# Altium schematic sheet Block_Diagramme.SchDoc
size A4; SheetNumber: 1; SheetTotal: 5
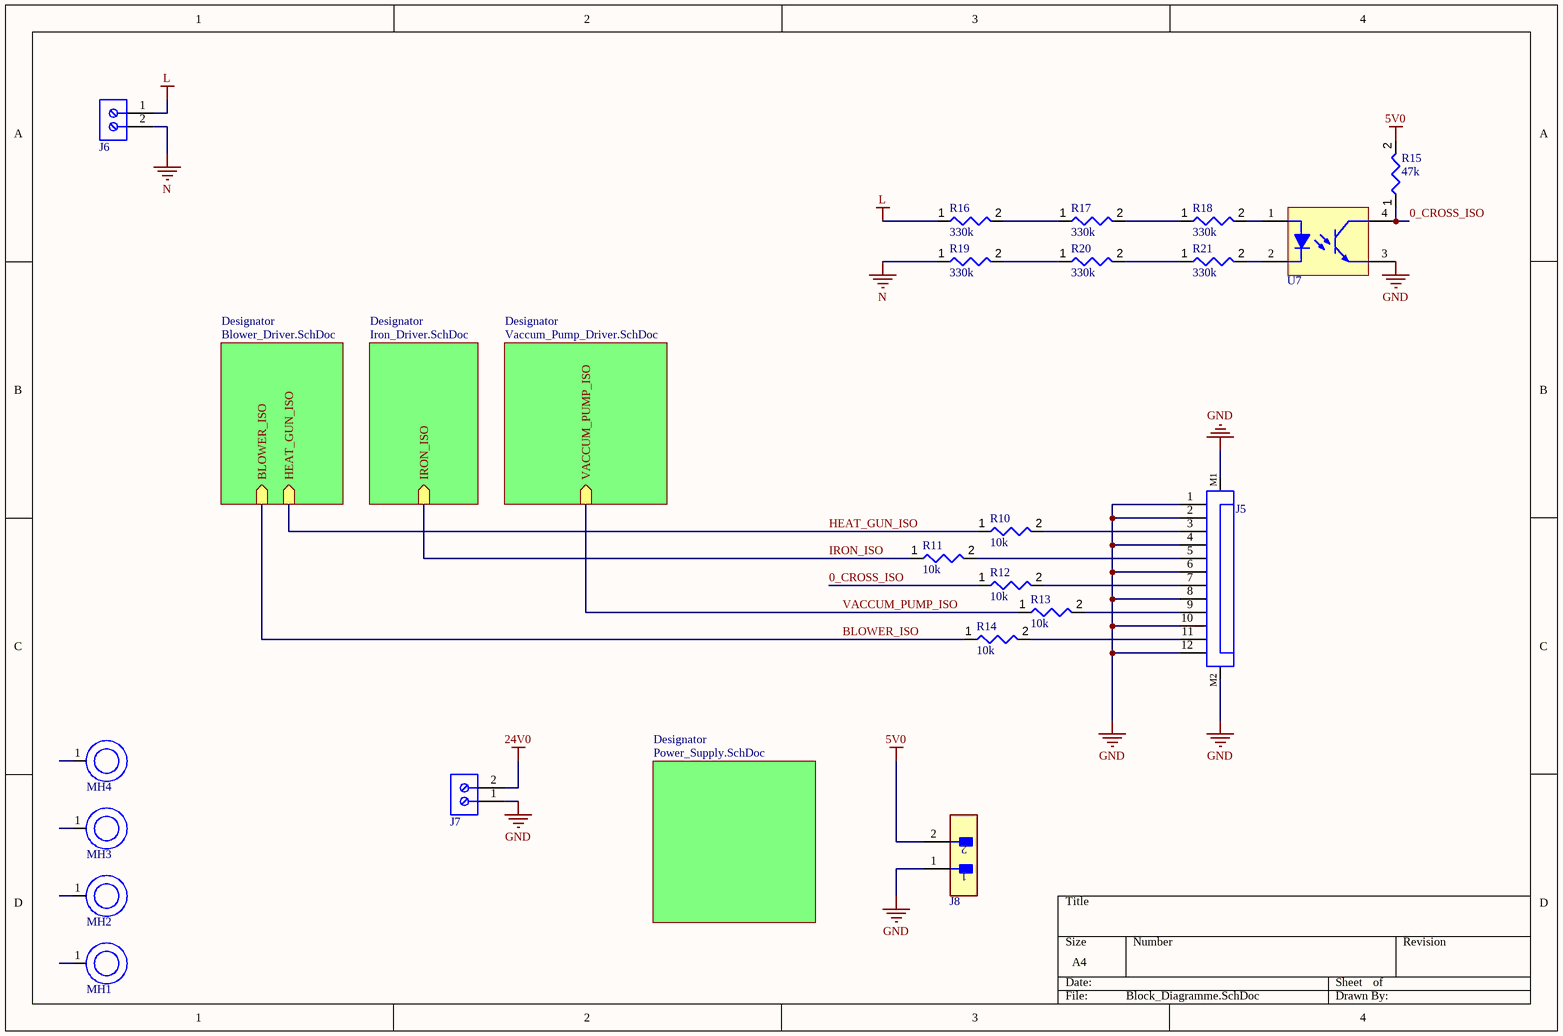
[diagram p0: Block_Diagramme.SchDoc]

## Parts
J5  687112183622  [687112183622]  (value not drawn)
J6  691137710002  [691137710002]  (value not drawn)
J7  691137710002  [691137710002]  (value not drawn)
J8  B2B-XH-A(LF)(SN)  [FP-B2B-XH-A_LF_SN-MFG]  (value not drawn)
MH1  3mm_Mounting_Hole  [Single_3mm_Mounting_Hole]  (value not drawn)
MH2  3mm_Mounting_Hole  [Single_3mm_Mounting_Hole]  (value not drawn)
MH3  3mm_Mounting_Hole  [Single_3mm_Mounting_Hole]  (value not drawn)
MH4  3mm_Mounting_Hole  [Single_3mm_Mounting_Hole]  (value not drawn)
R10  value 10k  [Generic_0603_RES]  (hidden comment: RES-TK_SMD-0603_VIS-CRCW_K_10K_1/10W_1%)
R11  value 10k  [Generic_0603_RES]  (hidden comment: RES-TK_SMD-0603_VIS-CRCW_K_10K_1/10W_1%)
R12  value 10k  [Generic_0603_RES]  (hidden comment: RES-TK_SMD-0603_VIS-CRCW_K_10K_1/10W_1%)
R13  value 10k  [Generic_0603_RES]  (hidden comment: RES-TK_SMD-0603_VIS-CRCW_K_10K_1/10W_1%)
R14  value 10k  [Generic_0603_RES]  (hidden comment: RES-TK_SMD-0603_VIS-CRCW_K_10K_1/10W_1%)
R15  value 47k  [Generic_0603_RES]  (hidden comment: RES-TK_SMD-0603_VIS-CRCW_K_47K_1/10W_1%)
R16  value 330k  [Generic_1206_RES]  (hidden comment: RES-TK_SMD-1206_VIS-CRCW_K_330K_1/4W_1%)
R17  value 330k  [Generic_1206_RES]  (hidden comment: RES-TK_SMD-1206_VIS-CRCW_K_330K_1/4W_1%)
R18  value 330k  [Generic_1206_RES]  (hidden comment: RES-TK_SMD-1206_VIS-CRCW_K_330K_1/4W_1%)
R19  value 330k  [Generic_1206_RES]  (hidden comment: RES-TK_SMD-1206_VIS-CRCW_K_330K_1/4W_1%)
R20  value 330k  [Generic_1206_RES]  (hidden comment: RES-TK_SMD-1206_VIS-CRCW_K_330K_1/4W_1%)
R21  value 330k  [Generic_1206_RES]  (hidden comment: RES-TK_SMD-1206_VIS-CRCW_K_330K_1/4W_1%)
U7  H11A817ASD  [FAIR-H11A817ASD-4_V]  (value not drawn)

## Sub-sheets
Designator = Blower_Driver.SchDoc: BLOWER_ISO (in), HEAT_GUN_ISO (in)
Designator = Iron_Driver.SchDoc: IRON_ISO (in)
Designator = Vaccum_Pump_Driver.SchDoc: VACCUM_PUMP_ISO (in)
Designator = Power_Supply.SchDoc: no entries

## Nets
5V0: J8.2 R15.2
24V0: J7.2
GND: J5.1 J5.2 J5.4 J5.6 J5.8 J5.10 J5.12 J5.M1 J5.M2 J7.1 J8.1 U7.3(EMITTER)
L: J6.1 R16.1
N: J6.2 R19.1
0_CROSS_ISO: R12.1 R15.1 U7.4(COLLECTOR)
BLOWER_ISO: R14.1 ; sheet Designator/BLOWER_ISO
HEAT_GUN_ISO: R10.1 ; sheet Designator/HEAT_GUN_ISO
IRON_ISO: R11.1 ; sheet Designator/IRON_ISO
VACCUM_PUMP_ISO: R13.1 ; sheet Designator/VACCUM_PUMP_ISO
NetJ5_3: J5.3 R10.2
NetJ5_5: J5.5 R11.2
NetJ5_7: J5.7 R12.2
NetJ5_9: J5.9 R13.2
NetJ5_11: J5.11 R14.2
NetR16_2: R16.2 R17.1
NetR17_2: R17.2 R18.1
NetR18_2: R18.2 U7.1(ANODE)
NetR19_2: R19.2 R20.1
NetR20_2: R20.2 R21.1
NetR21_2: R21.2 U7.2(CATHODE)

Not connected (* = marked no-connect by the designer): MH1 1; MH2 1; MH3 1; MH4 1

## Library data of the parts
J5 = CMP-1502-01592-2: NexarPartId: 81848331; Gender: Receptacle; Contact Resistance: 30mΩ; Pitch: 500µm; Current Rating: 400mA; Insulation Resistance: 100MΩ; Operating Supply Voltage: 50V; Min Operating Temperature: -25°C; Packaging: Tape and Reel; Orientation: Horizontal; Number of Pins: 12; Length: 6.6mm; Max Operating Temperature: 85°C; Lead Pitch: 500µm; RoHS: Compliant
J6 J7 = CMP-001-0029-2: 2P Block Terminal; RoHS Compliant: Yes
J8 = CMP-001-0161-1: CONNECTOR HEADER, XH SERIES, 2 POSITION, 2.50MM, Press-Fit Solder, Detent Lock, Natural; Current Rating: 3A; Connector Type: Male Pin; Voltage Rating (AC): 250V; Wire/Cable Gauge: 22AWG; Number of Contacts: 2; Pitch: 2.5mm; Contact Resistance: 20mΩ; Insulation Resistance: 1GΩ; Fastening Type: Detent; REACH SVHC: Yes; Orientation: Straight; Depth: 5.75mm; Width: 6.35mm; Max Operating Temperature: 85°C; Mounting Technology: Through Hole; China RoHS: Compliant; Lead Pitch: 2.5mm; Contact Gender: Male; Contact Material: Copper, Tin; Terminal Pitch: 2.5mm; Termination: Solder; Max Voltage Rating (AC): 250V; Lead Free: Lead Free; Pins: 2; Color: Natural; Lifecycle Status: Production; Max Current Rating: 3A; Height: 7mm; Min Operating Temperature: -25°C; Weight: 28.349523g; Housing Color: White; Number of Rows: 1; Length: 7.4mm; Housing Material: Polyamide; Voltage Rating: 250V; Max Voltage Rating (DC): 250V; Number of Positions: 2; Contact Plating: Tin; RoHS: Compliant
MH1-MH4 = CMP-001-0046-3: 3.2mm, sPad Mounting Hole; Size: 3mm
R10-R14 = CMP-009-00246-1: Fixed Resistor, Metal Glaze/thick Film, 0.1W, 10000ohm, 75V, 1% +/-Tol, 100ppm/Cel, Surface Mount, 0603; Power: 100mW; Mounting Technology: Surface Mount; Pins: 2; Min Operating Temperature: -55°C; Tolerance: 1%; RoHS Compliant: Yes; Max Operating Temperature: 155°C; Case/Package: 0603; Voltage Rating: 75V
R15 = CMP-009-00207-2: Fixed Resistor, Metal Glaze/thick Film, 0.1W, 47000ohm, 75V, 1% +/-Tol, 100ppm/Cel, Surface Mount, 0603; Power: 100mW; Case/Package: 0603; Max Operating Temperature: 155°C; Voltage Rating: 75V; RoHS Compliant: Yes; Min Operating Temperature: -55°C; Tolerance: 1%; Mounting Technology: Surface Mount; Pins: 2
R16-R21 = CMP-009-00015-1: Res Thick Film 1206 330K Ohm 1% 1/4W ±100ppm/°C Molded SMD SMD Paper T/R; Power: 750mW; Voltage Rating: 200V; Max Operating Temperature: 155°C; Case/Package: 1206; Tolerance: 1%; Mounting Technology: Surface Mount; Min Operating Temperature: -55°C; RoHS Compliant: Yes; Pins: 2
U7 = CMP-001-0167-1: OptoCouplers & OptoIsolators Optocoupler SM-DIP4 Phototransistor; Power Dissipation: 200mW; Number of Circuits: 1; Output Current per Channel: 50mA; Fall Time: 18µs; Forward Voltage: 1.5V; Dark Current: 100nA; Isolation Voltage: 5kV; Collector Emitter Breakdown Voltage: 70V; Reverse Breakdown Voltage: 6V; Current Transfer Ratio: 80%; Collector Emitter Saturation Voltage: 200mV; Min Operating Temperature: -55°C; Case/Package: SMD/SMT; RoHS: Compliant; Forward Current: 50mA; Lifecycle Status: Obsolete; Max Power Dissipation: 200mW; Continuous Collector Current: 50mA; Pins: 4; Lead Free: Lead Free; Number of Channels: 1; Rise Time: 18µs; Max Operating Temperature: 100°C; Collector Emitter Voltage (VCEO): 70V; Output Voltage: 70V; Max Collector Current: 50mA; Packaging: Tape and Reel; Number of Elements: 1